# EAGLE schematic LIS3DHTR (EAGLE 9.6.2)
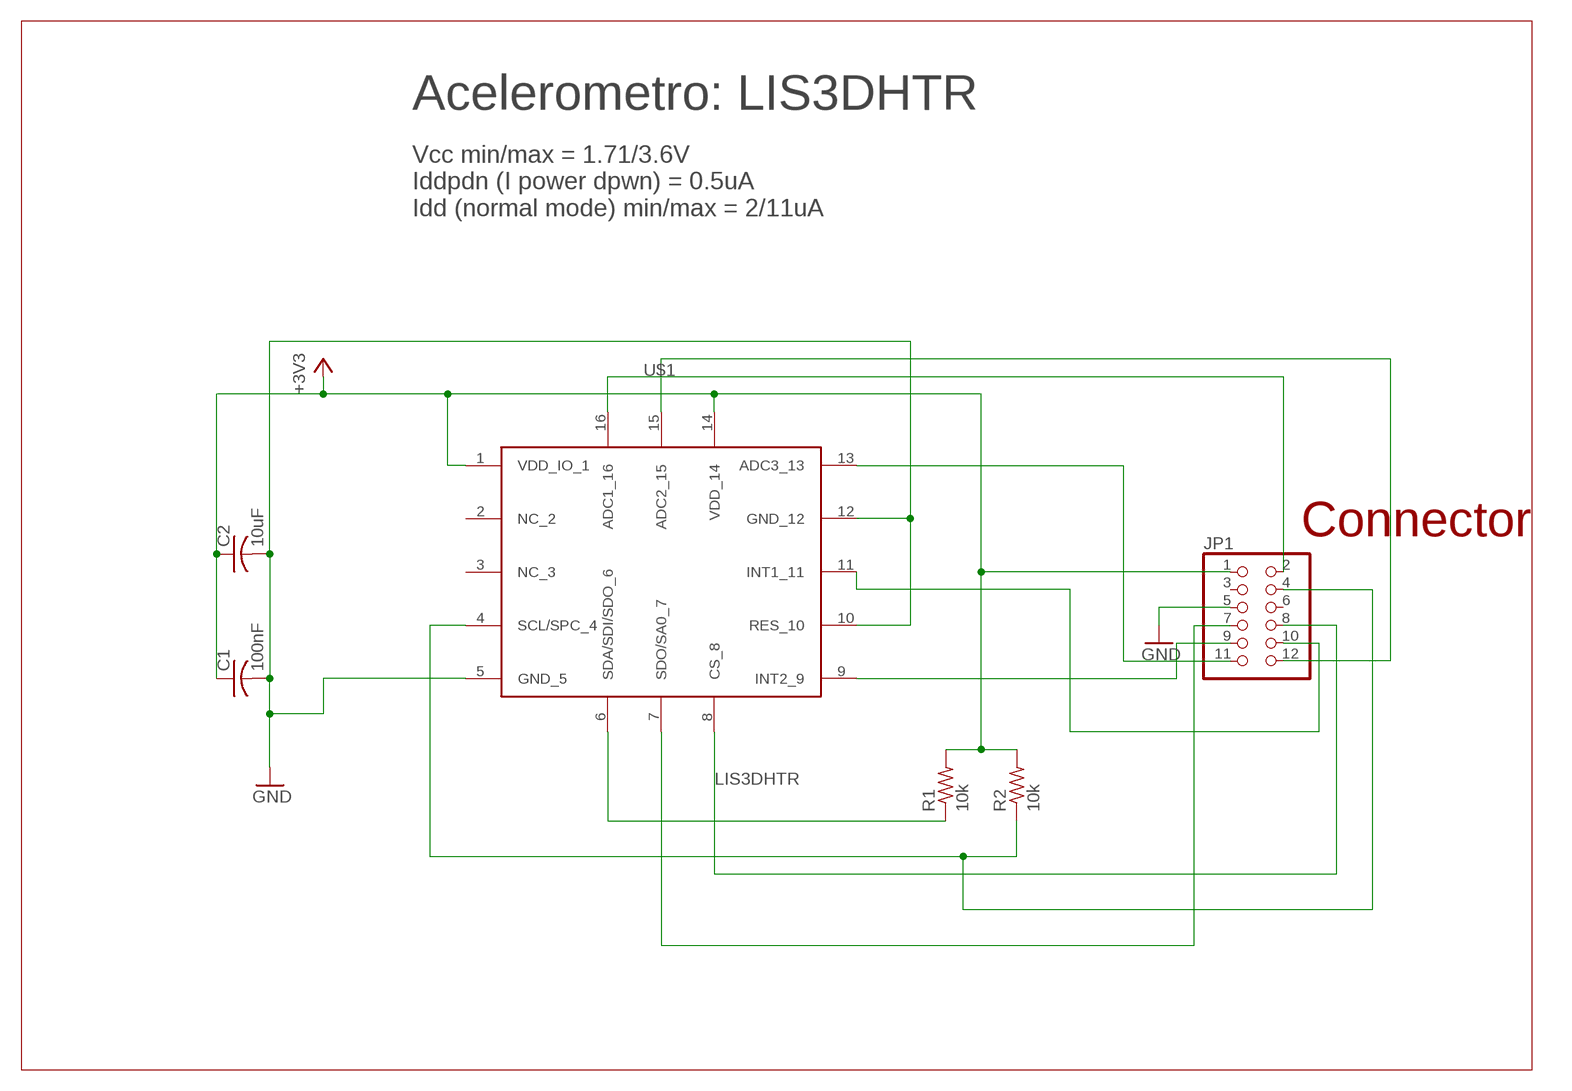
[diagram p0: schematic, sheet 1]

## Parts
C1  100nF  C-USC0805  [C0805]
C2  10uF  C-USC0805  [C0805]
JP1  PINHD-2X6/90  [2X06/90]
R1  10k  R-US_R0805  [R0805]
R2  10k  R-US_R0805  [R0805]
U$1  LIS3DHTR  [LGA-16-3X3]

## Nets
+3V3: C1.1 C2.1 JP1.1 R1.2 R2.2 U$1.1(VDD_IO_1) U$1.14(VDD_14)
GND: C1.2 C2.2 JP1.5 U$1.5(GND_5) U$1.10(RES_10) U$1.12(GND_12)
N$1: JP1.4 R2.1 U$1.4(SCL/SPC_4)
N$2: R1.1 U$1.6(SDA/SDI/SDO_6)
N$3: JP1.7 U$1.7(SDO/SA0_7)
N$4: JP1.8 U$1.8(CS_8)
N$5: JP1.9 U$1.9(INT2_9)
N$6: JP1.10 U$1.11(INT1_11)
N$7: JP1.11 U$1.13(ADC3_13)
N$8: JP1.12 U$1.15(ADC2_15)
N$9: JP1.2 U$1.16(ADC1_16)
Unconnected: JP1.3 JP1.6 U$1.2(NC_2) U$1.3(NC_3)

## Notes on the sheet
- Acelerometro: LIS3DHTR
- Vcc min/max = 1.71/3.6V
  Iddpdn (I power dpwn) = 0.5uA
  Idd (normal mode) min/max = 2/11uA
- Connector

## Library data of the parts
C1 = rcl:C-US: CAPACITOR, American symbol; PARTNO: GCM21BR72A104KA37L; SPICEPREFIX: C
C2 = rcl:C-US: CAPACITOR, American symbol; PARTNO: EDK106M035A9BAA; SPICEPREFIX: C
JP1 = PPPC062LJBN-RC - Sullins Connector Solutions:PINHD-2X6: PIN HEADER
R1 R2 = rcl:R-US_: RESISTOR, American symbol; PARTNO: RC0805FR-0710KL; SPICEPREFIX: R
U$1 = LIS3DHTR-STM:LIS3DHTR